# EasyEDA Pro project FKM3.epro, board PCB8
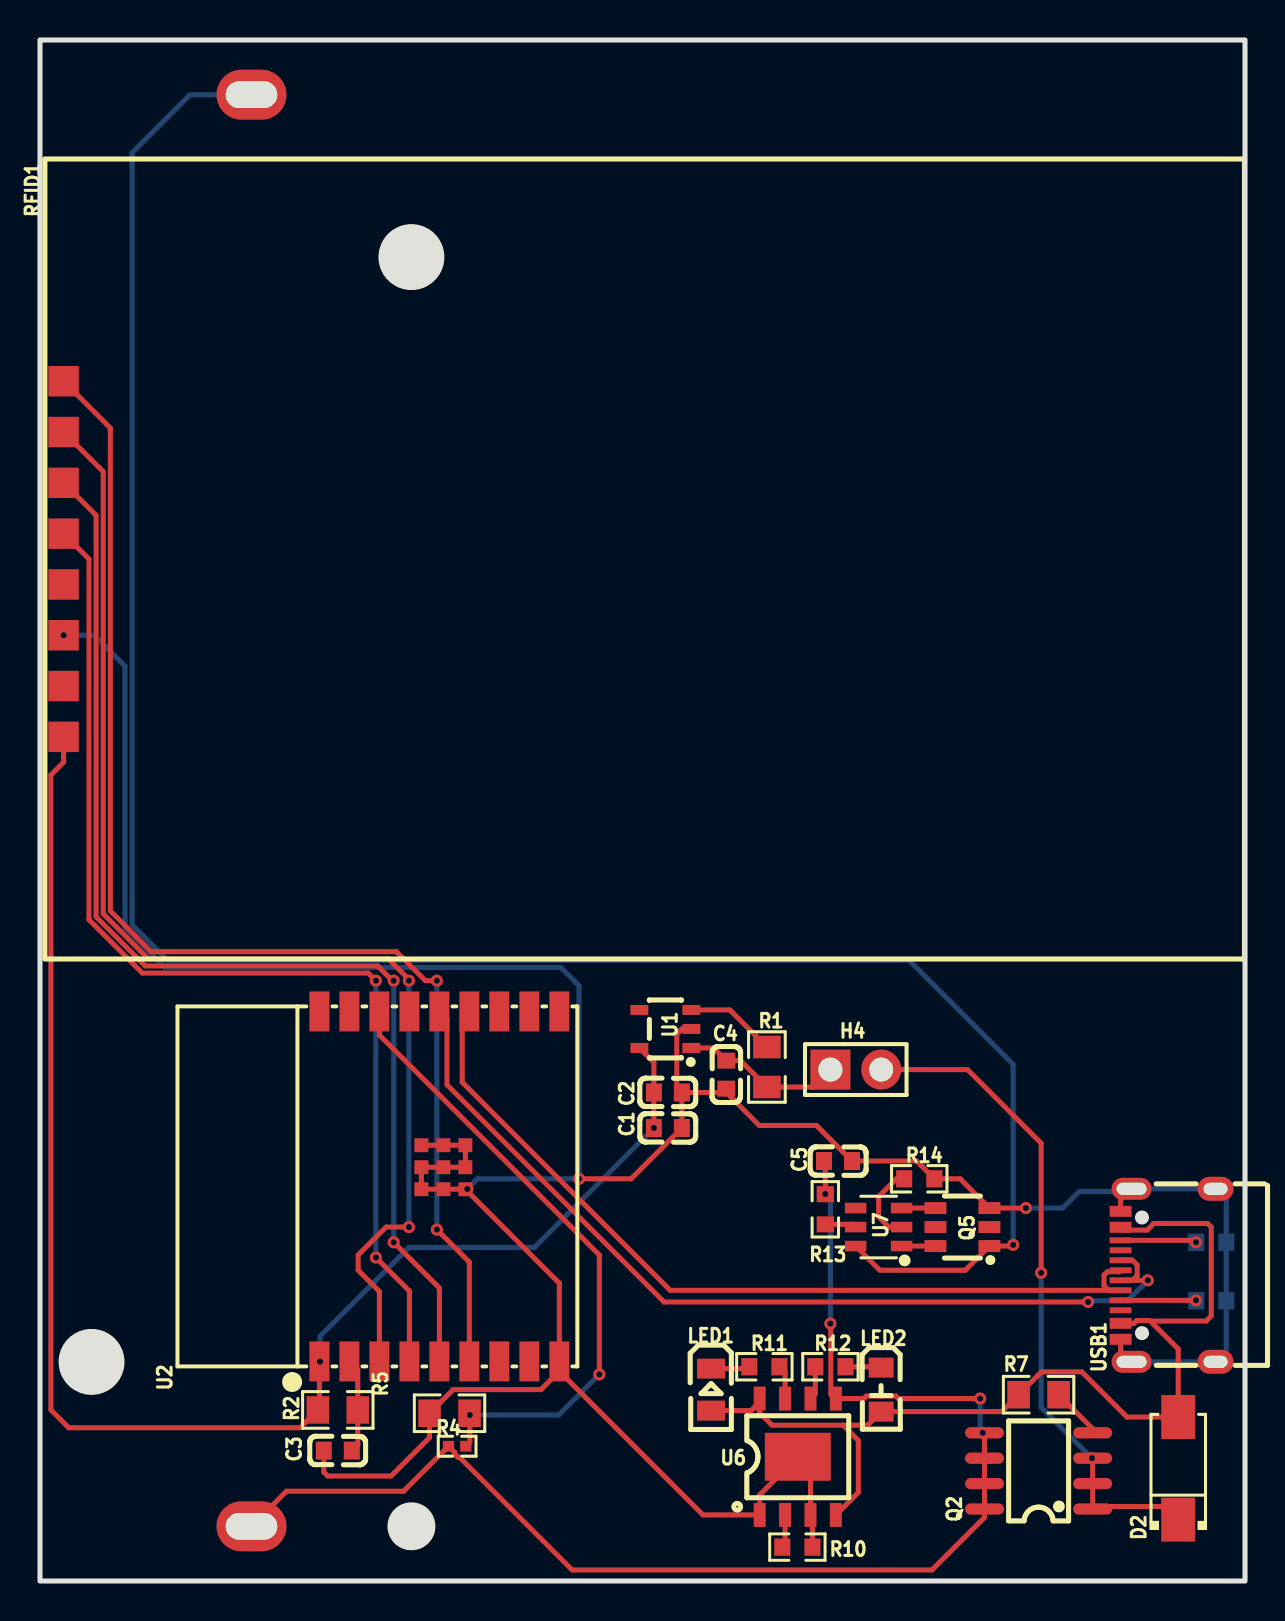
[diagram p13: board, top side]
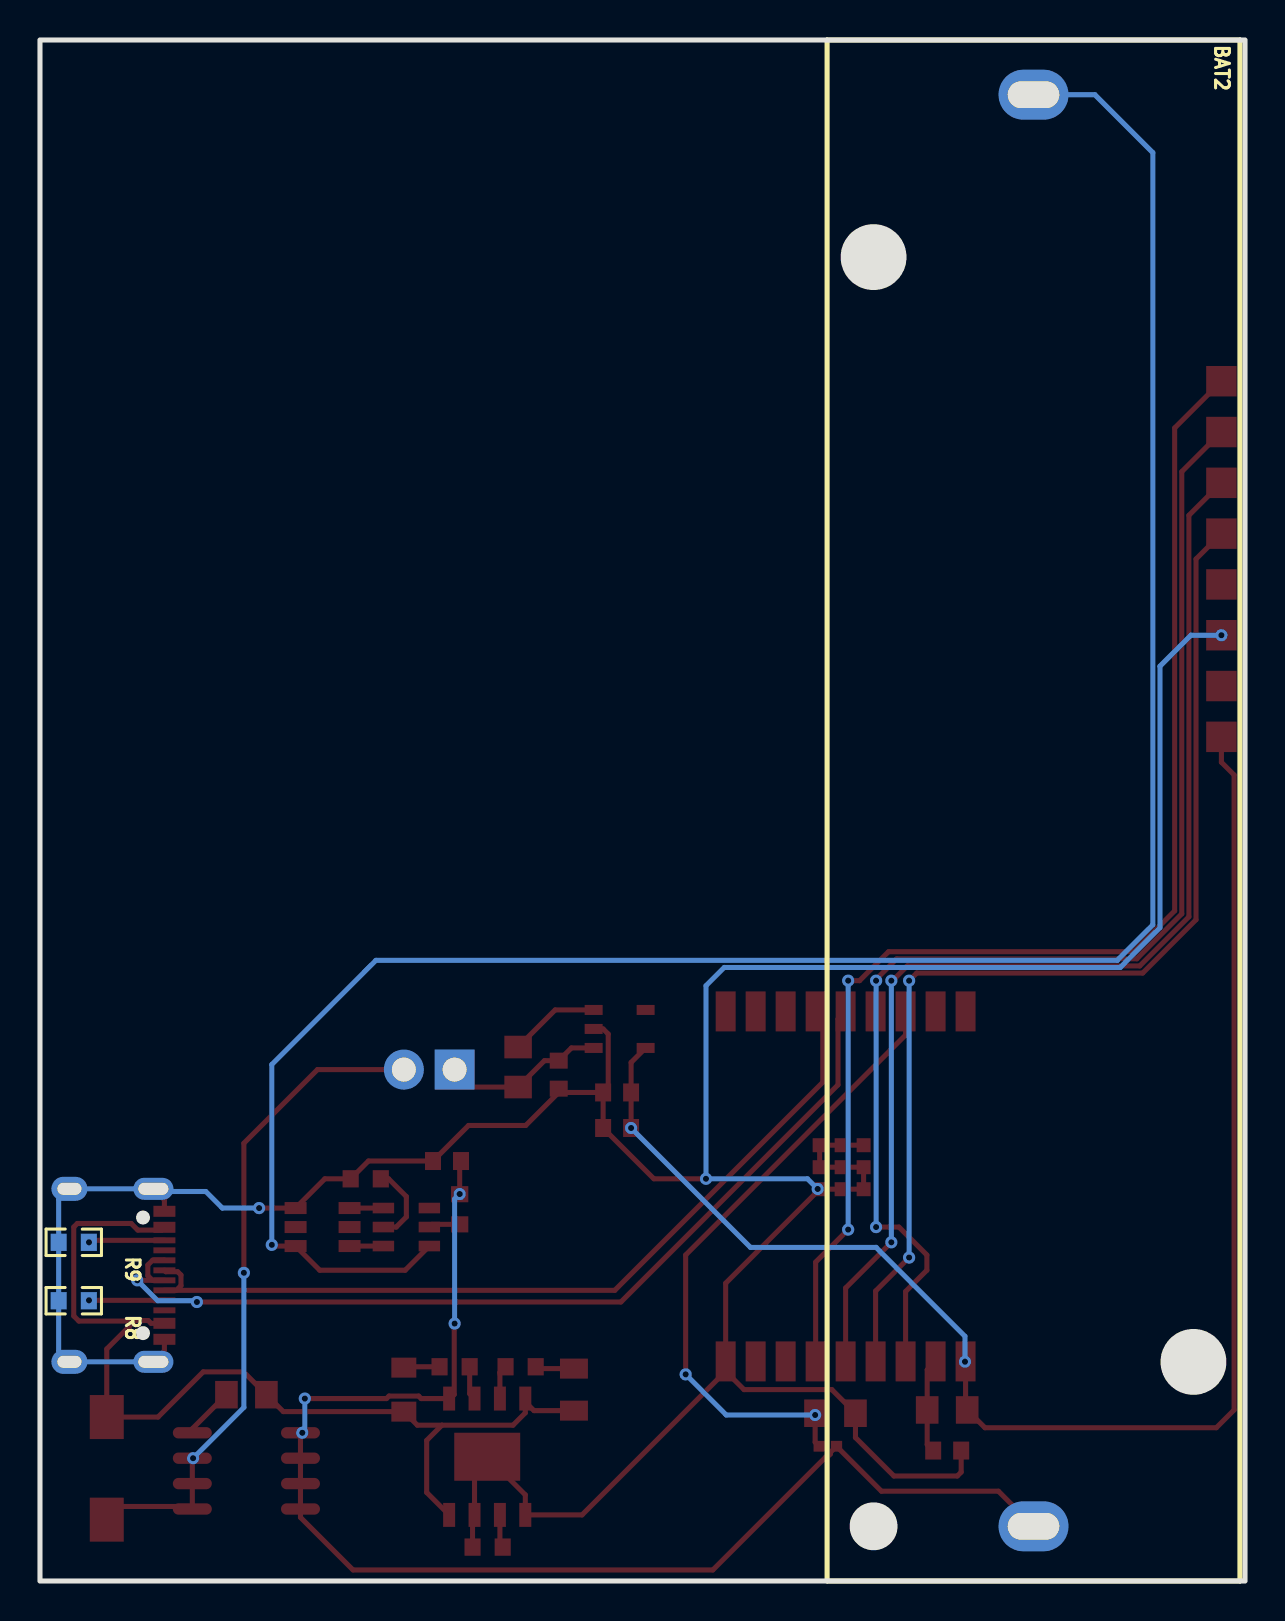
[diagram p14: board, bottom side, seen from below]

Outline 60.27 x 77.05 mm; copper layers: Top Layer, Bottom Layer. Coordinates in mm from the lower left corner of the outline.
Outline path: rectangle 0,77.05 60.27,0
Stack: Top Layer 0.035mm / Dielectric1 1.51mm FR4 er 4.5 / Bottom Layer 0.035mm

## Design rules (mm)
template: JLCPCB Capability(Two Layers Board)
spacing copperThickness1oz (default): track to track 0.102, other pairs 0.152 to 0.3
spacing copperThickness2oz: track to track 0.203, other pairs 0.152 to 0.3
track width copperThickness1oz (default): min 0.127, default 0.254, max 2.54
track width copperThickness2oz: min 0.203, default 0.254, max 2.54
differential pair differentialPair (default): width min 0.127, default 0.254, max 2.54; gap min 0.152, default 0.152
via viaSize (default): diameter min 0.5, default 0.61, max 10; hole min 0.3, default 0.305, max 6.3

## Placement (name value [footprint] x y rotation side)
BAT2  BH-18650-A6AJ003  [BAT-TH_BH-18650-A5BJ003]  10.58 38.52 270 bottom
C1  10uF  [C0603]  31.41 22.65 0 top
C2  100nF  [C0603]  31.41 24.43 0 top
C3  1uF  [C0603]  14.9 6.52 0 top
C4  10uF  [C0603]  34.33 25.32 270 top
C5  10uF  [C0603]  39.92 21 180 top
D2  SS14  [SMA_L4.2-W2.6-LS5.3-RD]  56.93 5.63 90 top
H4  PW SWITCH  [HDR-TH_2P-P2.54-V-M]  40.81 25.57 0 top
LED1  KT-0805G  [LED0805-R-RD]  33.57 9.57 270 top
LED2  LTST-C170TBKT  [LED0805-RD_BLUE]  42.08 9.57 270 top
Q2  AOSP21321  [SOIC-8_L5.0-W4.0-P1.27-LS6.0-BL]  49.95 5.5 90 top
Q5  FS8205A  [SOT-23-6_L2.9-W1.6-P0.95-LS2.8-BR]  46.14 17.7 0 top
R1  10kΩ  [R0805]  36.36 25.7 270 top
R2  10kΩ  [R0805]  14.9 8.55 0 top
R4  6.8kΩ  [R0402]  20.87 6.74 0 top
R5  10kΩ  [R0805]  20.49 8.39 180 top
R7  10kΩ  [R0805]  49.95 9.31 0 top
R8  5100  [R0603]  58.59 14.01 180 bottom
R9  5100  [R0603]  58.59 16.94 180 bottom
R10  1.2k  [R0603]  37.88 1.69 0 top
R11  1k  [R0603]  36.23 10.71 0 top
R12  1k  [R0603]  39.53 10.71 180 top
R13  100  [R0603]  39.28 18.59 90 top
R14  1k  [R0603]  43.98 20.11 180 top
RFID1  -  [RFID-RC522-Board]  5.5 12.62 0 top
U1  AP7366-33W5-7  [SOT-25_L3.0-W1.6-P0.95-LS2.8-BL]  31.28 27.6 90 top
U2  2.4GHz  [BULETM-SMD_ESPRESSIF_ESP32-C3-WROOM-02-N4-4MB]  19.98 19.73 90 top
U6  TP4056  [ESOP-8_L4.9-W3.9-P1.27-LS6.0-BL-EP]  37.9 6.21 0 top
U7  DW01A  [SOT-23-6_L2.9-W1.6-P0.95-LS2.8-BL]  41.95 17.7 90 top
USB1  TYPE-C 16PIN 2MD(073)  [USB-C-SMD_TYPE-C-6PIN-2MD-073]  56.43 15.28 90 top

## Footprints (pads in the part's own frame, mm; a bottom-side part is the same pattern mirrored in y, then rotated)
BAT-TH_BH-18650-A5BJ003
  oval 2.5x3.5 hole 1.34x2.58: 1(-35.79,0) 2(35.79,0)
BULETM-SMD_ESPRESSIF_ESP32-C3-WROOM-02-N4-4MB
  rect 2x1 smd: 1(-8.75,6) 2(-8.75,4.5) 3(-8.75,3) 4(-8.75,1.5) 5(-8.75,0) 6(-8.75,-1.5) 7(-8.75,-3) 8(-8.75,-4.5) 9(-8.75,-6) 10(8.75,-6) 11(8.75,-4.5) 12(8.75,-3) 13(8.75,-1.5) 14(8.75,0) 15(8.75,1.5) 16(8.75,3) 17(8.75,4.5) 18(8.75,6)
  rect 0.7x0.7 smd: 19(-0.14,0.9) 19(-0.14,-0.2) 19(-0.14,-1.3) 19(0.96,0.9) 19(0.96,-0.2) 19(0.96,-1.3) 19(2.06,0.9) 19(2.06,-0.2) 19(2.06,-1.3)
C0603
  rect 0.8x0.9 smd: 1(-0.7,0) 2(0.7,0)
ESOP-8_L4.9-W3.9-P1.27-LS6.0-BL-EP
  rect 0.6x1.2 smd: 1(-1.905,-2.909) 2(-0.635,-2.909) 3(0.635,-2.909) 4(1.905,-2.909) 5(1.905,2.909) 6(0.635,2.909) 7(-0.635,2.909) 8(-1.905,2.909)
  rect 3.3x2.4 smd: 9(0,0)
HDR-TH_2P-P2.54-V-M
  rect 2x2 hole 1.2: 1(-1.27,0)
  round 2 hole 1.2: 2(1.27,0)
LED0805-R-RD
  rect 1x1.399 smd: 1(1.05,0) 2(-1.05,0)
LED0805-RD_BLUE
  rect 1x1.25 smd: 1(-1.1,0) 2(1.1,0)
R0402
  rect 0.566x0.54 smd: 1(-0.433,0) 2(0.433,0)
R0603
  rect 0.806x0.864 smd: 1(-0.753,0) 2(0.753,0)
R0805
  rect 1.133x1.377 smd: 1(-1,0) 2(1,0)
RFID-RC522-Board
  rect 1.524x1.524 smd: 1(-4.318,47.371) 2(-4.318,44.831) 3(-4.318,42.291) 4(-4.318,39.751) 5(-4.318,37.211) 6(-4.318,34.671) 7(-4.318,32.131) 8(-4.318,29.591)
SMA_L4.2-W2.6-LS5.3-RD
  rect 2.2x1.7 smd: 1(-2.566,0) 2(2.566,0)
SOIC-8_L5.0-W4.0-P1.27-LS6.0-BL
  oval 0.569x1.95 smd: 1(-1.905,-2.705) 2(-0.635,-2.705) 3(0.635,-2.705) 4(1.905,-2.705) 5(1.905,2.705) 6(0.635,2.705) 7(-0.635,2.705) 8(-1.905,2.705)
SOT-23-6_L2.9-W1.6-P0.95-LS2.8-BL
  rect 0.532x1.072 smd: 1(-0.95,-1.149) 2(0,-1.149) 3(0.95,-1.149) 4(0.95,1.149) 5(0,1.149) 6(-0.95,1.149)
SOT-23-6_L2.9-W1.6-P0.95-LS2.8-BR
  rect 1.1x0.6 smd: 1(1.35,-0.95) 2(1.35,0) 3(1.35,0.95) 4(-1.35,0.95) 5(-1.35,0) 6(-1.35,-0.95)
SOT-25_L3.0-W1.6-P0.95-LS2.8-BL
  rect 0.5x0.9 smd: 1(-0.95,-1.3) 2(0,-1.3) 3(0.95,-1.3) 4(0.95,1.3) 5(-0.95,1.3)
USB-C-SMD_TYPE-C-6PIN-2MD-073
  rect 0.55x1.1 smd: 1(-3.2,2.375) 2(-2.4,2.375) 11(2.4,2.375) 12(3.2,2.375)
  rect 0.3x1.1 smd: 3(-1.75,2.375) 4(-1.25,2.375) 5(-0.75,2.375) 6(-0.25,2.375) 7(0.25,2.375) 8(0.75,2.375) 9(1.25,2.375) 10(1.75,2.375)
  oval 1.1x2 hole 0.6x1.5: 13(-4.325,1.825) 14(4.325,1.825)
  oval 1.2x1.8 hole 0.6x1.2: 13(-4.325,-2.375) 14(4.325,-2.375)

## Nets
As in the schematic.

Pads without a net: Q5 2 5; RFID1 5 7; U1 4; U2 7 8 10 11 12 15 17 18; U7 4; USB1 3 9

## Via types
v1: diameter 0.61, hole 0.305, Top Layer to Bottom Layer, 27 vias

## Routing (per net, layer and track width the routed paths; a pad name or vN(x,y) marks a point on that pad's centre or on a via; arc(x,y) is an arc through that point)
GND: length 170.9
  Top Layer w0.254: 54.6,19.61 54.05,19.06 USB1.12 ; C2.2 31.85,24.68 31.85,27.35 32.11,27.6 U1.2 ; C2.2 C1.2 29.57,20.11 v1(26.96,20.11) ; C2.2 34.14,24.43 C4.2 34.33,24.43 35.98,22.78 38.84,22.78 C5.1 43.84,21 R14.1 46.03,20.11 47.49,18.65 v1(49.31,18.65) ; 25.98,10.49 25.06,9.57 20.67,9.57 R5.2 19.49,7.17 17.56,5.25 14.39,5.25 14.2,5.44 C3.1 ; 25.98,10.49 33.16,3.3 36,3.3 36,4.31 U6.9 38.54,5.58 38.54,3.3 38.64,3.21 R10.2 ; 25.98,10.49 U2.9 25.98,14.89 U2.19 U2.19 U2.19 19.08,20.69 21.28,20.69 U2.19 U2.19 U2.19 ; 54.6,10.96 54.05,11.51 USB1.1
  Bottom Layer w0.254: v1(49.31,18.65) 51.15,18.65 51.98,19.47 54.47,19.47 54.6,19.61 USB1.14 59.34,19.07 R9.1 R8.1 59.34,11.5 USB1.13 54.6,10.96 ; v1(1.18,47.29) 2.7,47.29 4.25,45.74 4.25,32.66 6.24,30.68 26.05,30.68 26.96,29.76 v1(26.96,20.11) 21.88,20.11 v1(21.37,19.6)
VBUS: length 8.1
  Top Layer w0.254: U1.1 33.69,26.65 C4.1 35.04,26.02 R1.2 38.66,24.7 H4.1
VCC: length 77.1
  Top Layer w0.254: U2.1 13.98,8.63 R2.1 13.01,7.66 1.44,7.66 0.55,8.55 0.55,40.3 1.18,40.94 RFID1.8 ; U1.5 30.71,25.93 C2.1 v1(30.71,22.65)
  Bottom Layer w0.254: v1(14.01,10.97) 14.01,12.24 18.45,16.68 24.74,16.68 v1(30.71,22.65)
B+: length 67.5
  Top Layer w0.254: R13.2 39.28,20.93 C5.2 ; BAT2.2 12.33,4.49 18.18,4.49 20.43,6.74 20.74,6.43 20.74,6.35 20.9,6.19 20.98,6.19 26.62,0.55 44.62,0.55 47.24,3.18 Q2.8 Q2.7 Q2.6 Q2.5 ; v1(39.53,12.87) 39.53,12.62 39.56,12.6 39.56,9.32 39.76,9.12 U6.5 41.21,9.12 41.33,9.25 42.82,9.25 42.94,9.12 v1(47.03,9.12)
  Bottom Layer w0.254: v1(39.53,12.87) 39.53,19.09 v1(39.28,19.35) ; v1(47.16,7.41) 47.03,7.54 v1(47.03,9.12)
B-: length 110.7
  Top Layer w0.254: v1(48.68,16.81) 48.62,16.75 47.49,16.75 46.28,15.54 42.01,15.54 40.8,16.75
  Bottom Layer w0.254: BAT2.1 7.51,74.31 4.61,71.42 4.61,32.81 6.39,31.03 43.47,31.03 48.68,25.82 v1(48.68,16.81)
BAT_SENS: length 31.7
  Top Layer w0.254: v1(21.5,8.3) 21.5,6.94 R4.2 ; v1(27.98,10.33) 27.98,16.3 16.98,27.3 U2.16
  Bottom Layer w0.254: v1(21.5,8.3) 25.95,8.3 v1(27.98,10.33)
SPI_CS: length 64.9
  Top Layer w0.254: RFID1.1 3.52,57.65 3.52,33.51 5.56,31.46 17.83,31.46 19.28,30.02 v1(19.85,30.02) ; U2.6 21.48,15.94 v1(19.85,17.57)
  Bottom Layer w0.254: v1(19.85,30.02) v1(19.85,17.57)
SPI_MISO: length 55.2
  Top Layer w0.254: U2.4 18.48,14.5 v1(16.8,16.17) ; RFID1.4 2.45,51.1 2.45,33.06 5.12,30.4 16.42,30.4 v1(16.8,30.02)
  Bottom Layer w0.254: v1(16.8,30.02) v1(16.8,16.17)
SPI_MOSI: length 58.6
  Top Layer w0.254: RFID1.3 2.81,53.28 2.81,33.21 5.27,30.75 16.89,30.75 17.63,30.02 v1(17.69,30.02) ; U2.5 19.98,14.65 v1(17.69,16.94)
  Bottom Layer w0.254: v1(17.69,30.02) v1(17.69,16.94)
SPI_SCK: length 62.8
  Top Layer w0.254: v1(18.45,17.7) 17.31,17.7 15.91,16.3 15.91,15.54 16.98,14.47 U2.3 ; v1(18.45,30.02) 18.45,30.08 17.42,31.11 5.41,31.11 3.16,33.36 3.16,55.47 RFID1.2
  Bottom Layer w0.254: v1(18.45,30.02) v1(18.45,17.7)
USB_D+: length 47
  Top Layer w0.254: 54.65,15.03 54.88,15.27 54.88,15.8 54.63,16.05 54.06,16.05 USB1.8 ; 54.65,15.03 v1(55.41,15.03) ; 54.65,15.03 USB1.6 ; v1(52.43,13.95) 31.22,13.95 20.36,24.81 20.36,28.1 U2.14
  Bottom Layer w0.254: v1(55.41,15.03) 54.39,14.01 52.49,14.01 v1(52.43,13.95)
USB_D-: length 42.7
  Top Layer w0.254: 53.46,14.53 53.22,14.77 53.22,15.3 53.39,15.46 53.98,15.46 USB1.7 ; 53.46,14.53 31.52,14.53 21.12,24.94 21.12,28.12 U2.13 ; 53.46,14.53 USB1.5
VUSB: length 51.2
  Top Layer w0.254: 36,8.95 35.56,8.52 LED1.1 ; 36,8.95 U6.8 ; 36,8.95 36,8.41 36.61,7.79 40.17,7.79 ; 40.17,7.79 40.93,7.03 40.93,4.43 39.81,3.3 ; 40.17,7.79 41.4,7.79 LED2.2 48.1,8.47 R7.1 50.09,10.46 52.11,10.46 54.37,8.2 D2.2 56.93,11.6 55.54,13 ; USB1.2 54.72,12.88 54.86,13.02 55.51,13.02 55.54,13 ; 55.54,13 58.33,13 58.59,13.25 58.59,17.7 58.41,17.88 55.71,17.88 55.38,17.54 54.19,17.54 USB1.11
$1N405: length 4.8
  Top Layer w0.254: C3.2 15.9,6.82 R2.2 15.9,10.56 U2.2
$1N1071: length 4.5
  Top Layer w0.254: U1.3 34.5,28.55 R1.1
$2N1363: length 33.4
  Top Layer w0.254: 52.65,6.27 52.65,3.73 56.27,3.73 D2.1 ; H4.2 46.39,25.57 50.08,21.89 v1(50.08,15.41)
  Bottom Layer w0.254: v1(50.08,15.41) 50.08,8.68 v1(52.62,6.14)
$2N1368: length 2.6
  Top Layer w0.254: R7.2 52.65,7.61 Q2.4
$2N1375: length 4
  Top Layer w0.254: R14.2 42.84,20.11 41.95,19.22 41.95,18.2 42.46,17.7 U7.2
$2N1376: length 1.7
  Top Layer w0.254: 44.79,18.65 43.1,18.65
$2N1379: length 1.7
  Top Layer w0.254: 43.1,16.75 44.79,16.75
$2N1382: length 1.6
  Top Layer w0.254: R13.1 40.66,17.83 U7.5
$2N1388: length 3.8
  Top Layer w0.254: USB1.4 v1(57.82,14.03)
$2N1391: length 3.8
  Top Layer w0.254: v1(57.82,16.94) 57.72,17.03 USB1.10
$2N1394: length 1.7
  Top Layer w0.254: U6.7 37.27,10.43 R11.2
$2N1395: length 1.7
  Top Layer w0.254: R12.2 38.78,9.36 38.54,9.12
$2N1399: length 1.7
  Top Layer w0.254: R10.1 37.27,1.83 37.27,3.3
$2N1401: length 1.8
  Top Layer w0.254: LED2.1 42.03,10.71 R12.1
$2N1402: length 2
  Top Layer w0.254: R11.1 35.39,10.62 LED1.2
